# EAGLE schematic Arche-RoboCore (EAGLE 9.6.2)

## Sheet 1 of 2
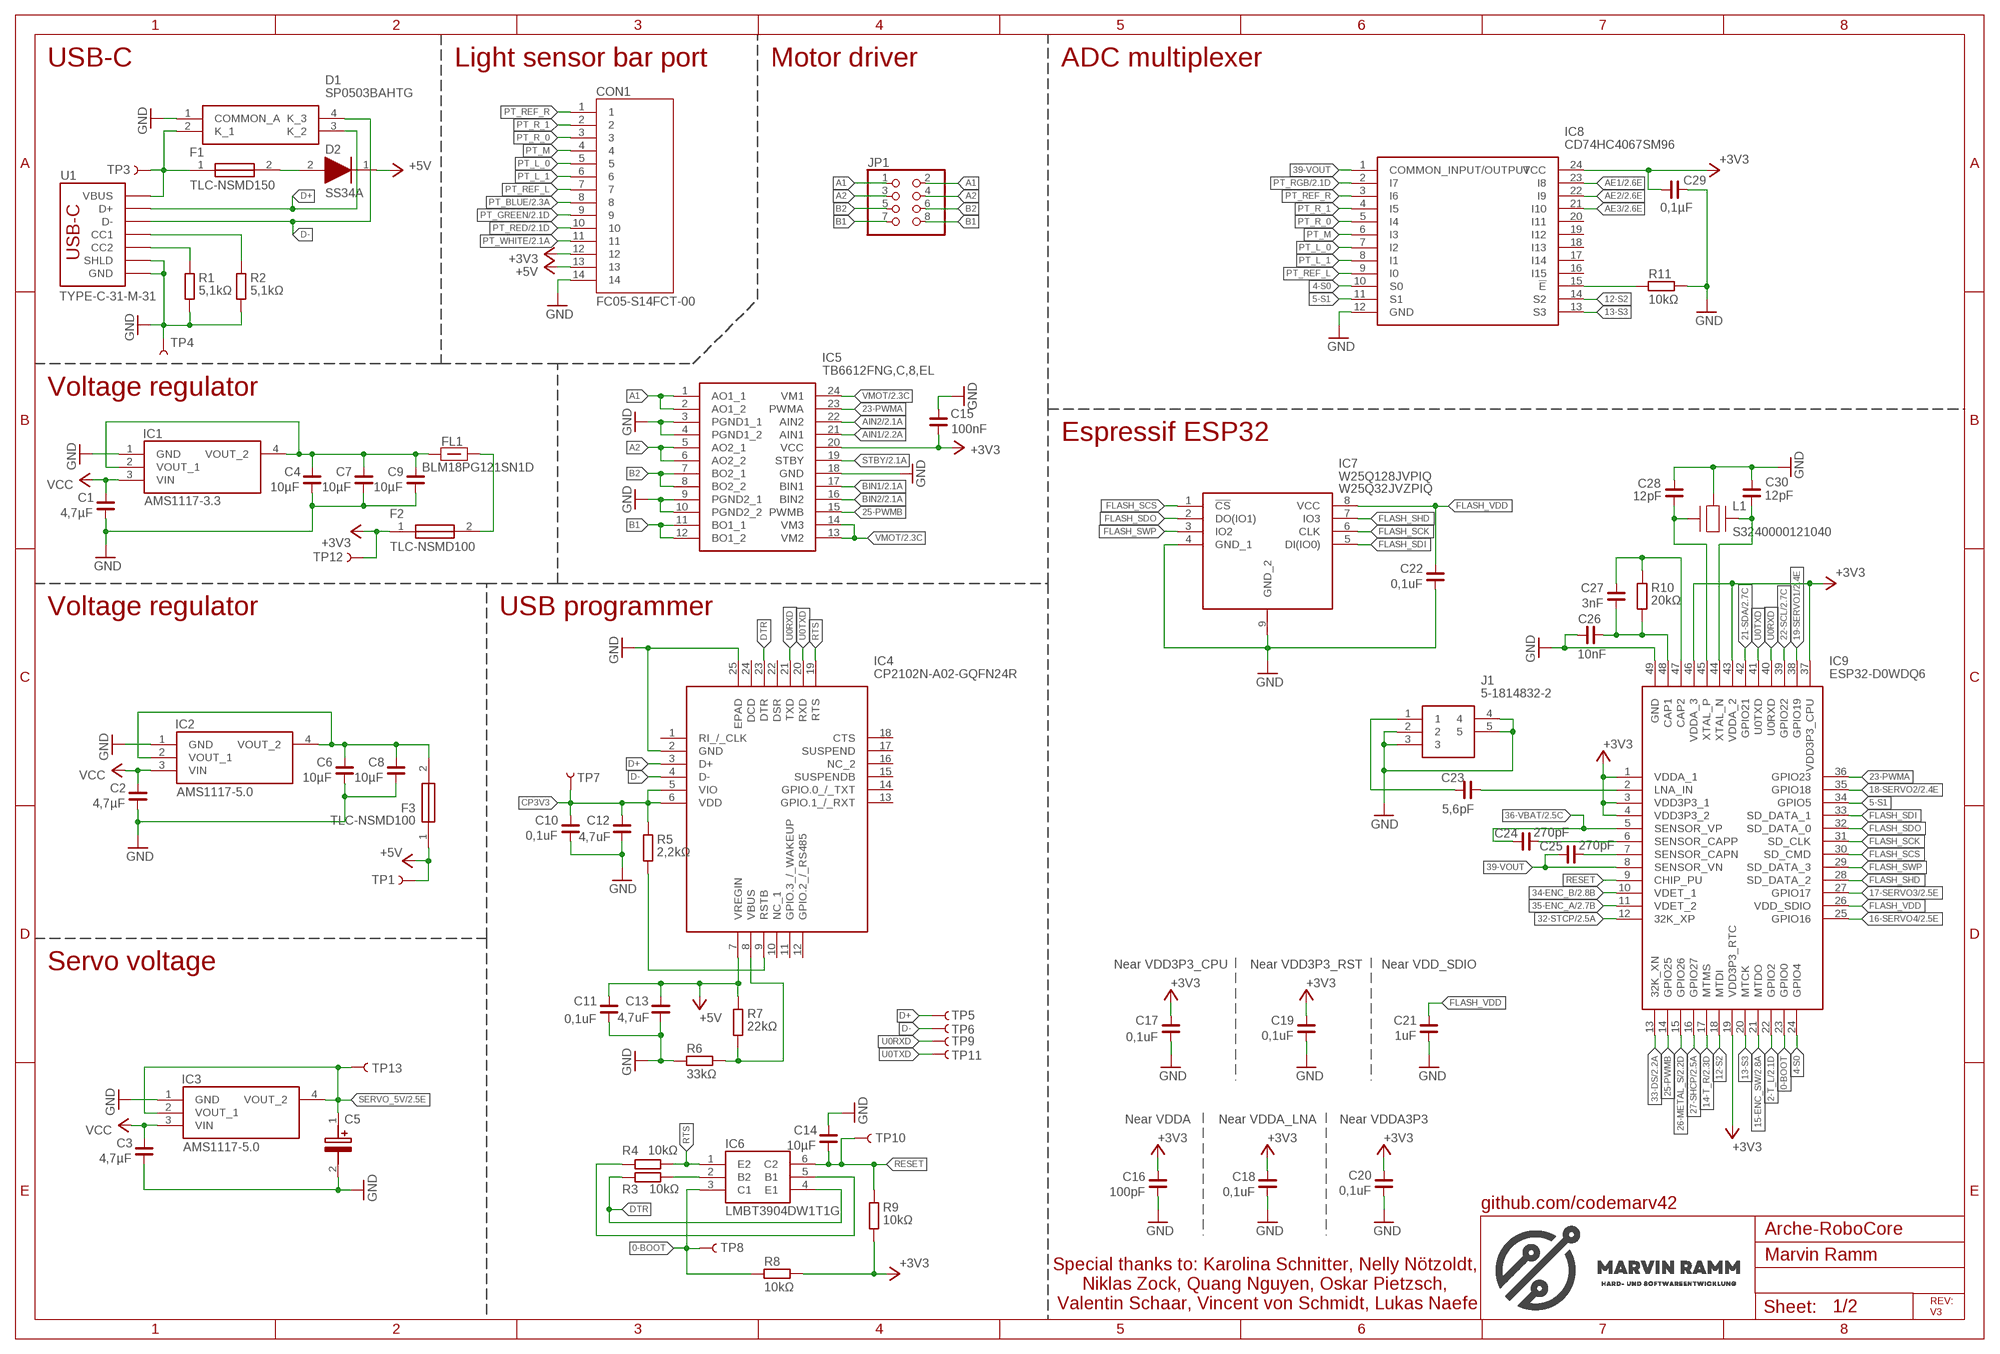
[diagram p0: schematic, sheet 1]

### Parts
C1  4,7µF  C_0603  [C0603]
C2  4,7µF  C_0603  [C0603]
C3  4,7µF  C_0603  [C0603]
C4  10µF  C_0603  [C0603]
C5  UUD1C151MCL1GS  [CAPAE660X800N]
C6  10µF  C_0603  [C0603]
C7  10µF  C_0603  [C0603]
C8  10µF  C_0603  [C0603]
C9  10µF  C_0603  [C0603]
C10  0,1uF  C_0402  [C0402]
C11  0,1uF  C_0402  [C0402]
C12  4,7uF  C_0402  [C0402]
C13  4,7uF  C_0402  [C0402]
C14  10µF  C_0603  [C0603]
C15  100nF  C_0402  [C0402]
C16  100pF  C_0402  [C0402]
C17  0,1uF  C_0402  [C0402]
C18  0,1uF  C_0402  [C0402]
C19  0,1uF  C_0402  [C0402]
C20  0,1uF  C_0402  [C0402]
C21  1uF  C_0402  [C0402]
C22  0,1uF  C_0402  [C0402]
C23  5,6pF  C_0402  [C0402]
C24  270pF  C_0402  [C0402]
C25  270pF  C_0402  [C0402]
C26  10nF  C_0402  [C0402]
C27  3nF  C_0402  [C0402]
C28  12pF  C_0402  [C0402]
C29  0,1µF  C_0402  [C0402]
C30  12pF  C_0402  [C0402]
CON1  FC05-S14FCT-00  [FC05-S14FCT-00]
D1  SP0503BAHTG  [SP0503BAHTG]
D2  SS34A  [DIOM5026X262N]
F1  NANOSMDC020F-2  [FUSC3216X82N]
F2  NANOSMDC020F-2  [FUSC3216X82N]
F3  NANOSMDC020F-2  [FUSC3216X82N]
FL1  BLM18PG121SN1D  [BLM18AG102BH1D]
IC1  AMS1117-3.3  [SOT229P700X180-4N]
IC2  AMS1117-3.3  [SOT229P700X180-4N]
IC3  AMS1117-3.3  [SOT229P700X180-4N]
IC4  CP2102N-A02-GQFN24R  [QFN50P400X400X80-25N]
IC5  TB6612FNG,C,8,EL  [SOP65P760X160-24N]
IC6  MMDT3904-TP  [SOT65P230X120-6N]
IC7  W25Q128JVPIQ  [SON127P800X600X80-9N]
IC8  CD74HC4067SM96  [SOP65P780X200-24N]
IC9  ESP32-D0WDQ6  [QFN40P600X600X90-49N]
J1  5-1814832-2  [518148322]
JP1  PINHD-2X4  [2X04]
L1  SMD-3225_4P16MHZ_20PF_10PPM_-4  [SMD3225_4P16MHZ20PF10PPM4085]
R1  5,1kΩ  R_0402  [R0402]
R2  5,1kΩ  R_0402  [R0402]
R3  10kΩ  R_0402  [R0402]
R4  10kΩ  R_0402  [R0402]
R5  2,2kΩ  R_0402  [R0402]
R6  33kΩ  R_0402  [R0402]
R7  22kΩ  R_0402  [R0402]
R8  10kΩ  R_0402  [R0402]
R9  10kΩ  R_0402  [R0402]
R10  20kΩ  R_0402  [R0402]
R11  10kΩ  R_0402  [R0402]
TP1  TEST-POINT3X5  [PAD.03X.05]
TP3  TEST-POINT3X5  [PAD.03X.05]
TP4  TEST-POINT3X5  [PAD.03X.05]
TP5  TEST-POINT3X5  [PAD.03X.05]
TP6  TEST-POINT3X5  [PAD.03X.05]
TP7  TEST-POINT3X5  [PAD.03X.05]
TP8  TEST-POINT3X5  [PAD.03X.05]
TP9  TEST-POINT3X5  [PAD.03X.05]
TP10  TEST-POINT3X5  [PAD.03X.05]
TP11  TEST-POINT3X5  [PAD.03X.05]
TP12  TEST-POINT3X5  [PAD.03X.05]
TP13  TEST-POINT3X5  [PAD.03X.05]
U1  TYPE-C-31-M-14  [TYPE-C-31-M-14_HRO]

### Nets
0-BOOT: IC6.3(C1) IC9.23(GPIO0) R8.2 TP8.1
2-T_L: IC9.22(GPIO2) ; also sheet 2
4-S0: IC8.10(S0) IC9.24(GPIO4)
5-S1: IC8.11(S1) IC9.34(GPIO5)
12-S2: IC8.14(S2) IC9.18(MTDI)
13-S3: IC8.13(S3) IC9.20(MTCK)
14-T_R: IC9.17(MTMS) ; also sheet 2
15-ENC_SW: IC9.21(MTDO) ; also sheet 2
16-SERVO4: IC9.25(GPIO16) ; also sheet 2
17-SERVO3: IC9.27(GPIO17) ; also sheet 2
18-SERVO2: IC9.35(GPIO18) ; also sheet 2
19-SERVO1: IC9.38(GPIO19) ; also sheet 2
21-SDA: IC9.42(GPIO21) ; also sheet 2
22-SCL: IC9.39(GPIO22) ; also sheet 2
23-PWMA: IC5.23(PWMA) IC9.36(GPIO23)
25-PWMB: IC5.15(PWMB) IC9.14(GPIO25)
26-METAL_S: IC9.15(GPIO26) ; also sheet 2
27-SHCP: IC9.16(GPIO27) ; also sheet 2
32-STCP: IC9.12(32K_XP) ; also sheet 2
33-DS: IC9.13(32K_XN) ; also sheet 2
34-ENC_B: IC9.10(VDET_1) ; also sheet 2
35-ENC_A: IC9.11(VDET_2) ; also sheet 2
36-VBAT: C24.1 IC9.5(SENSOR_VP) ; also sheet 2
39-VOUT: C25.1 IC8.1(COMMON_INPUT/OUTPUT) IC9.8(SENSOR_VN)
+3V3: C15.1 C16.2 C17.2 C18.2 C19.2 C20.2 C29.1 CON1.12 F2.1 IC5.20(VCC) IC8.24(VCC) IC9.1(VDDA_1) IC9.3(VDD3P3_1) IC9.4(VDD3P3_2) IC9.19(VDD3P3_RTC) IC9.37(VDD3P3_CPU) IC9.43(VDDA_2) IC9.46(VDDA_3) R8.1 R9.2 TP12.1 ; also sheet 2
+5V: C11.2 C13.2 CON1.13 D2.1(K) F3.1 IC4.7(VREGIN) R7.1 TP1.1 ; also sheet 2
A1: IC5.1(AO1_1) IC5.2(AO1_2) JP1.1 JP1.2
A2: IC5.5(AO2_1) IC5.6(AO2_2) JP1.3 JP1.4
AE1: IC8.23(I8) ; also sheet 2
AE2: IC8.22(I9) ; also sheet 2
AE3: IC8.21(I10) ; also sheet 2
AIN1: IC5.21(AIN1) ; also sheet 2
AIN2: IC5.22(AIN2) ; also sheet 2
B1: IC5.11(BO1_1) IC5.12(BO1_2) JP1.7 JP1.8
B2: IC5.7(BO2_1) IC5.8(BO2_2) JP1.5 JP1.6
BIN1: IC5.17(BIN1) ; also sheet 2
BIN2: IC5.16(BIN2) ; also sheet 2
CP3V3: C10.2 C12.2 IC4.5(VIO) IC4.6(VDD) R5.1 TP7.1
D+: D1.3(K_2) IC4.3(D+) TP5.1 U1.A6(D+) U1.B6(D+)
D-: D1.4(K_3) IC4.4(D-) TP6.1 U1.A7(D-) U1.B7(D-)
DTR: IC4.23(DTR) IC6.4(E1) R3.2
FLASH_SCK: IC7.6(CLK) IC9.31(SD_CLK)
FLASH_SCS: IC7.1(!CS) IC9.30(SD_CMD)
FLASH_SDI: IC7.5(DI(IO0)) IC9.33(SD_DATA_1)
FLASH_SDO: IC7.2(DO(IO1)) IC9.32(SD_DATA_0)
FLASH_SHD: IC7.7(IO3) IC9.28(SD_DATA_2)
FLASH_SWP: IC7.3(IO2) IC9.29(SD_DATA_3)
FLASH_VDD: C21.2 C22.2 IC7.8(VCC) IC9.26(VDD_SDIO)
GND: C1.2 C2.2 C3.2 C4.2 C5.2(-) C6.2 C7.2 C8.2 C9.2 C10.1 C11.1 C12.1 C13.1 C14.1 C15.2 C16.1 C17.1 C18.1 C19.1 C20.1 C21.1 C22.1 C26.1 C28.1 C29.2 C30.1 CON1.14 D1.1(COMMON_A) IC1.1(GND) IC2.1(GND) IC3.1(GND) IC4.2(GND) IC4.25(EPAD) IC5.3(PGND1_1) IC5.4(PGND1_2) IC5.9(PGND2_1) IC5.10(PGND2_2) IC5.18(GND) IC7.4(GND_1) IC7.9(GND_2) IC8.12(GND) IC9.49(GND) J1.2 J1.3 J1.4 J1.5 L1.2(GND_2) L1.4(GND_2) R1.2 R2.2 R6.2 R11.2 TP4.1 U1.A1B12(GND) U1.B1A12(GND) U1.P$1(SHLD) U1.P$2(SHLD) U1.P$3(SHLD) U1.P$4(SHLD) U1.P$5(SHLD) U1.P$6(SHLD) U1.P$7(SHLD) U1.P$8(SHLD) U1.P$9(SHLD) U1.P$10(SHLD) U1.P$11(SHLD) U1.P$12(SHLD) U1.P$14(SHLD) U1.P$16(SHLD) U1.P$18(SHLD) U1.P$20(SHLD) ; also sheet 2
N$5: D2.2(A) F1.2
N$7: C6.1 C8.1 F3.2 IC2.2(VOUT_1) IC2.4(VOUT_2)
N$8: F2.2 FL1.1
N$9: C4.1 C7.1 C9.1 FL1.2 IC1.2(VOUT_1) IC1.4(VOUT_2)
N$10: R1.1 U1.B5(CC2)
N$11: R2.1 U1.A5(CC1)
N$12: IC4.9(RSTB) R5.2
N$13: IC4.8(VBUS) R6.1 R7.2
N$20: IC8.15(!E) R11.1
N$23: C23.1 IC9.2(LNA_IN)
N$24: C26.2 C27.1 IC9.48(CAP1) R10.2
N$25: C27.2 IC9.47(CAP2) R10.1
N$26: C30.2 IC9.44(XTAL_N) L1.3(CRYSTAL_2)
N$27: C28.2 IC9.45(XTAL_P) L1.1(CRYSTAL_1)
N$29: C23.2 J1.1
N$37: IC6.5(B1) R4.2
N$38: IC6.2(B2) R3.1
N$39: C25.2 IC9.7(SENSOR_CAPN)
N$41: C24.2 IC9.6(SENSOR_CAPP)
PT_BLUE: CON1.8 ; also sheet 2
PT_GREEN: CON1.9 ; also sheet 2
PT_L_0: CON1.5 IC8.7(I2)
PT_L_1: CON1.6 IC8.8(I1)
PT_M: CON1.4 IC8.6(I3)
PT_R_0: CON1.3 IC8.5(I4)
PT_R_1: CON1.2 IC8.4(I5)
PT_RED: CON1.10 ; also sheet 2
PT_REF_L: CON1.7 IC8.9(I0)
PT_REF_R: CON1.1 IC8.3(I6)
PT_RGB: IC8.2(I7) ; also sheet 2
PT_WHITE: CON1.11 ; also sheet 2
RESET: C14.2 IC6.6(C2) IC9.9(CHIP_PU) R9.1 TP10.1
RTS: IC4.19(RTS) IC6.1(E2) R4.1
SERVO_5V: C5.1(+) IC3.2(VOUT_1) IC3.4(VOUT_2) TP13.1 ; also sheet 2
STBY: IC5.19(STBY) ; also sheet 2
U0RXD: IC4.21(TXD) IC9.40(U0RXD) TP9.1
U0TXD: IC4.20(RXD) IC9.41(U0TXD) TP11.1
USBDIRECT: D1.2(K_1) F1.1 TP3.1 U1.A4B9(VBUS) U1.B4A9(VBUS)
VCC: C1.1 C2.1 C3.1 IC1.3(VIN) IC2.3(VIN) IC3.3(VIN) ; also sheet 2
VMOT: IC5.13(VM2) IC5.14(VM3) IC5.24(VM1) ; also sheet 2
Unconnected: IC4.1(RI_/_CLK) IC4.10(NC_1) IC4.11(GPIO.3_/_WAKEUP) IC4.12(GPIO.2_/_RS485) IC4.13(GPIO.1_/_RXT) IC4.14(GPIO.0_/_TXT) IC4.15(SUSPENDB) IC4.16(NC_2) IC4.17(SUSPEND) IC4.18(CTS) IC4.22(DSR) IC4.24(DCD) IC8.16(I15) IC8.17(I14) IC8.18(I13) IC8.19(I12) IC8.20(I11)

### Notes on the sheet
- USB-C | Light sensor bar port | Motor driver | ADC multiplexer
- TLC-NSMD150
- TYPE-C-31-M-31
- Voltage regulator
- Espressif ESP32
- W25Q32JVZPIQ
- S3240000121040
- TLC-NSMD100
- Voltage regulator | USB programmer
- AMS1117-5.0
- TLC-NSMD100
- Near VDD3P3_CPU | Near VDD3P3_RST | Near VDD_SDIO
- Servo voltage
- Near VDDA | Near VDDA_LNA | Near VDDA3P3
- AMS1117-5.0
- LMBT3904DW1T1G | github.com/codemarv42
- Marvin Ramm
- Special thanks to: Karolina Schnitter, Nelly Nötzoldt, 
  Niklas Zock, Quang Nguyen, Oskar Pietzsch, 
  Valentin Schaar, Vincent von Schmidt, Lukas Naefe
- REV:
  V3

## Sheet 2 of 2
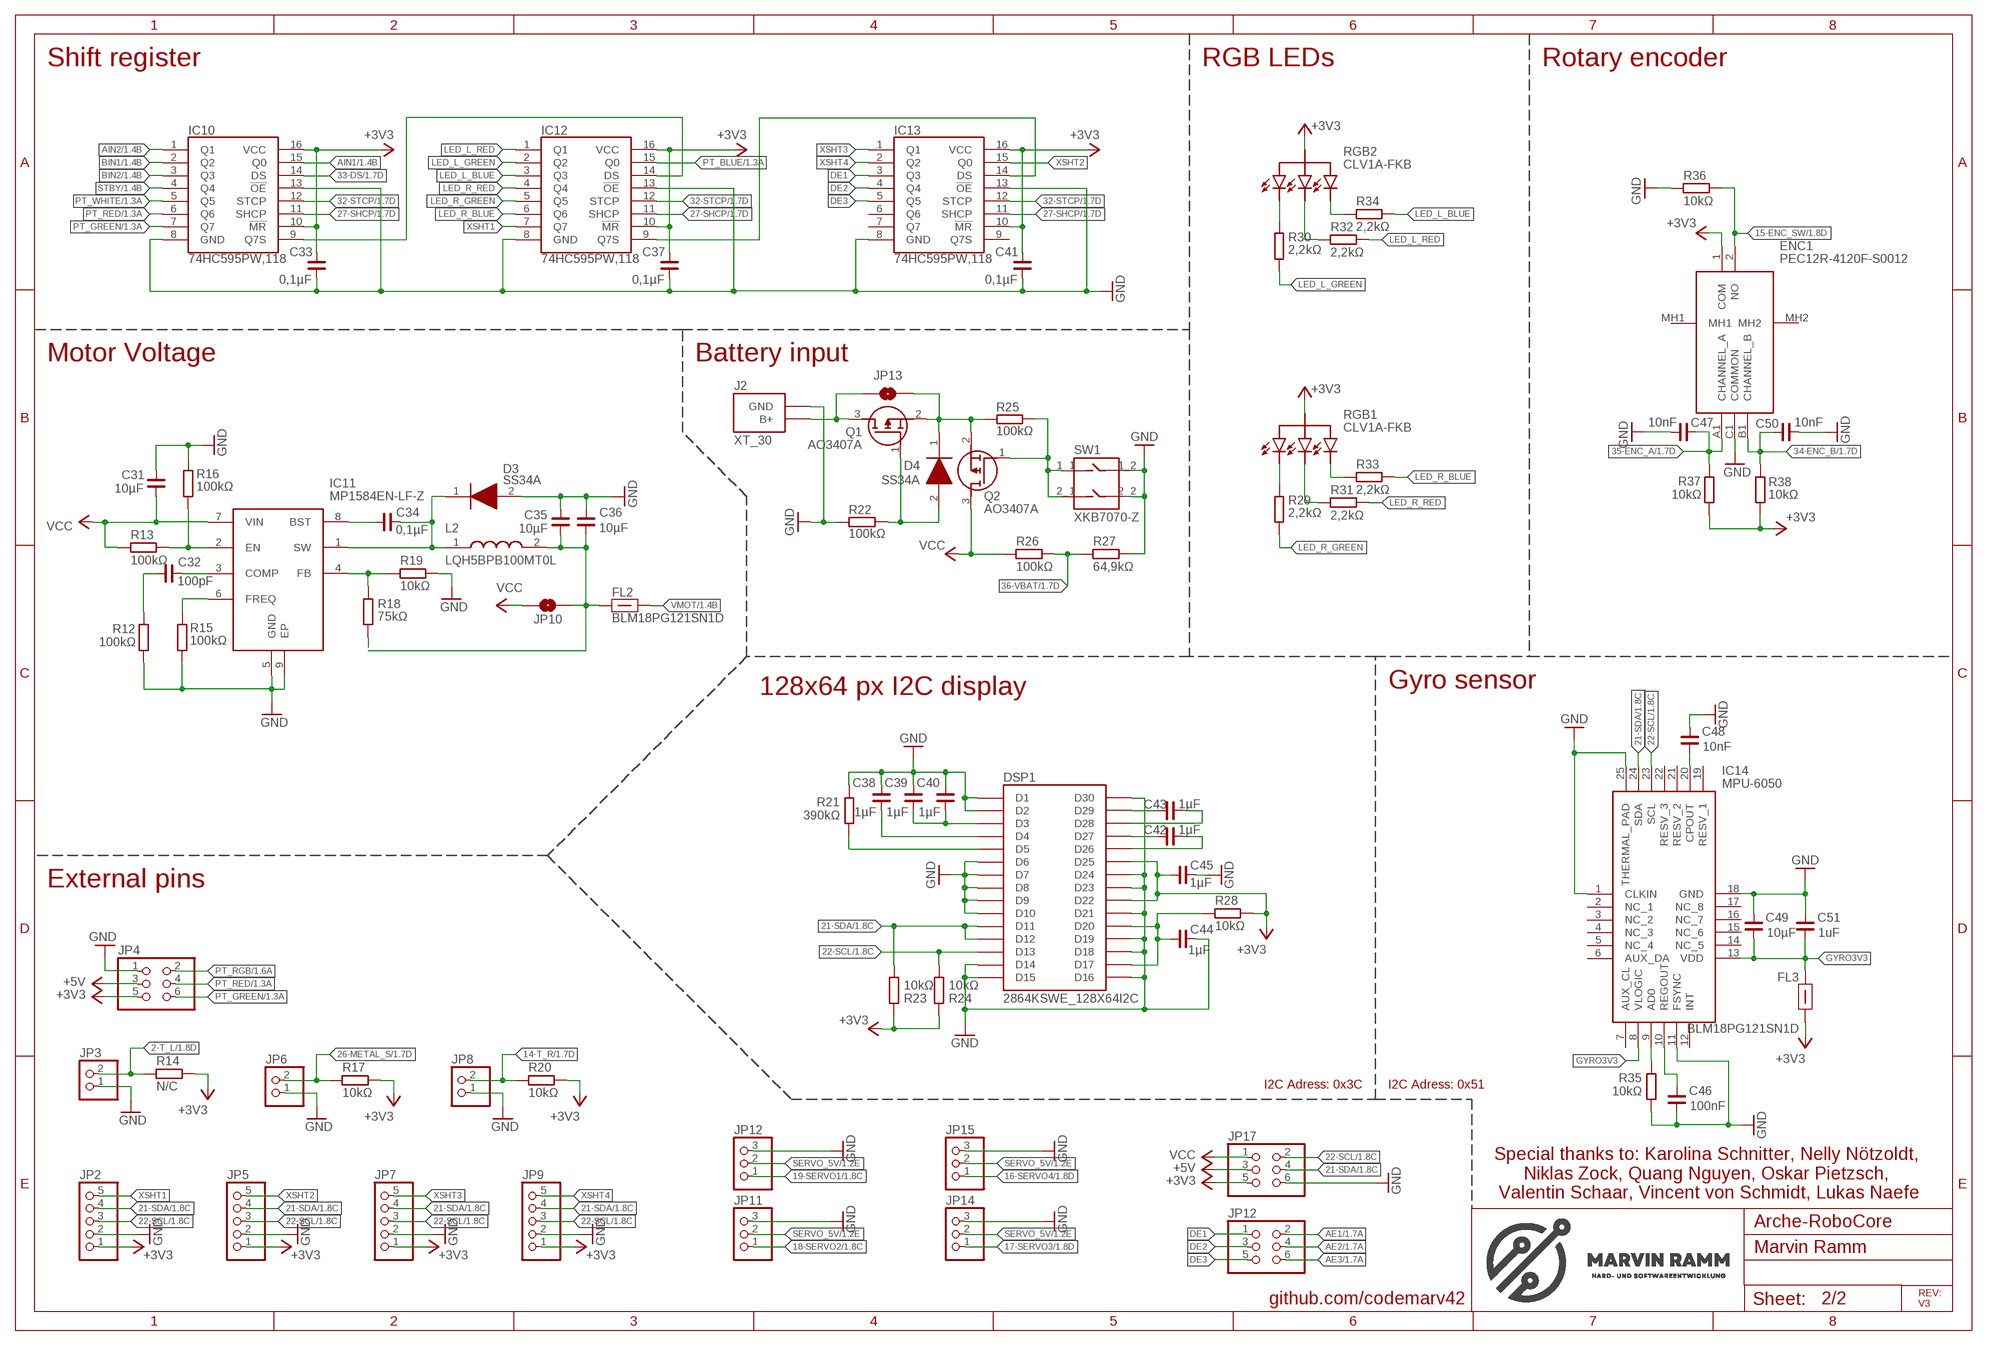
[diagram p1: schematic, sheet 2]

### Parts
C31  10µF  C_0603  [C0603]
C32  100pF  C_0402  [C0402]
C33  0,1µF  C_0402  [C0402]
C34  0,1µF  C_0402  [C0402]
C35  10µF  C_0603  [C0603]
C36  10µF  C_0603  [C0603]
C37  0,1µF  C_0402  [C0402]
C38  1µF  C_0402  [C0402]
C39  1µF  C_0402  [C0402]
C40  1µF  C_0402  [C0402]
C41  0,1µF  C_0402  [C0402]
C42  1µF  C_0402  [C0402]
C43  1µF  C_0402  [C0402]
C44  1µF  C_0402  [C0402]
C45  1µF  C_0402  [C0402]
C46  100nF  C_0402  [C0402]
C47  10nF  C_0402  [C0402]
C48  10nF  C_0402  [C0402]
C49  10µF  C_0603  [C0603]
C50  10nF  C_0402  [C0402]
C51  1uF  C_0402  [C0402]
D3  SS34A  [DIOM5026X262N]
D4  SS34A  [DIOM5026X262N]
DSP1  2864KSWE_128X64I2C  [2864KSWE_128X64I2C]
ENC1  PEC12R-4230F-S0024  [PEC12R4230FS0024]
FL2  BLM18PG121SN1D  [BLM18AG102BH1D]
FL3  BLM18PG121SN1D  [BLM18AG102BH1D]
IC10  74HC595PW,118  [SOP65P640X110-16N]
IC11  MP1584EN-LF-Z  [SOIC127P600X170-9N]
IC12  74HC595PW,118  [SOP65P640X110-16N]
IC13  74HC595PW,118  [SOP65P640X110-16N]
IC14  MPU-6050  [QFN50P400X400X95-25N]
J2  XT_30  [XT_30]
JP2  PINHD-1X5  [1X05]
JP3  PINHD-1X2  [1X02]
JP4  PINHD-2X3  [2X03]
JP5  PINHD-1X5  [1X05]
JP6  PINHD-1X2  [1X02]
JP7  PINHD-1X5  [1X05]
JP8  PINHD-1X2  [1X02]
JP9  PINHD-1X5  [1X05]
JP10  JUMPER-SMT_2_NO_SILK  [SMT-JUMPER_2_NO_SILK]
JP11  PINHD-1X3  [1X03]
JP12  PINHD-1X3  [1X03]
JP13  JUMPER-SMT_2_NO_SILK  [SMT-JUMPER_2_NO_SILK]
JP14  PINHD-1X3  [1X03]
JP15  PINHD-1X3  [1X03]
JP16  PINHD-2X3  [2X03]
JP17  PINHD-2X3  [2X03]
L2  LQH5BPB100MT0L  [LQH5BPB100MT0L]
Q1  AO3407A  [SOT95P280X125-3N]
Q2  AO3407A  [SOT95P280X125-3N]
R12  100kΩ  R_0402  [R0402]
R13  100kΩ  R_0402  [R0402]
R14  N/C  R_0402  [R0402]
R15  100kΩ  R_0402  [R0402]
R16  100kΩ  R_0402  [R0402]
R17  10kΩ  R_0402  [R0402]
R18  75kΩ  R_0402  [R0402]
R19  10kΩ  R_0402  [R0402]
R20  10kΩ  R_0402  [R0402]
R21  390kΩ  R_0402  [R0402]
R22  100kΩ  R_0402  [R0402]
R23  10kΩ  R_0402  [R0402]
R24  10kΩ  R_0402  [R0402]
R25  100kΩ  R_0402  [R0402]
R26  100kΩ  R_0402  [R0402]
R27  64,9kΩ  R_0402  [R0402]
R28  10kΩ  R_0402  [R0402]
R29  2,2kΩ  R_0402  [R0402]
R30  2,2kΩ  R_0402  [R0402]
R31  2,2kΩ  R_0402  [R0402]
R32  2,2kΩ  R_0402  [R0402]
R33  2,2kΩ  R_0402  [R0402]
R34  2,2kΩ  R_0402  [R0402]
R35  10kΩ  R_0402  [R0402]
R36  10kΩ  R_0402  [R0402]
R37  10kΩ  R_0402  [R0402]
R38  10kΩ  R_0402  [R0402]
RGB1  RGBLED  [RGBLED]
RGB2  RGBLED  [RGBLED]
SW1  XKB7070-Z  [XKB7070-Z]

### Nets
2-T_L: JP3.2 R14.1 ; also sheet 1
14-T_R: JP8.2 R20.1 ; also sheet 1
15-ENC_SW: ENC1.2(NO) R36.2 ; also sheet 1
16-SERVO4: JP15.1 ; also sheet 1
17-SERVO3: JP14.1 ; also sheet 1
18-SERVO2: JP11.1 ; also sheet 1
19-SERVO1: JP12.1 ; also sheet 1
21-SDA: DSP1.D11 DSP1.D12 IC14.24(SDA) JP2.4 JP5.4 JP7.4 JP9.4 JP17.4 R23.1 ; also sheet 1
22-SCL: DSP1.D13 IC14.23(SCL) JP2.3 JP5.3 JP7.3 JP9.3 JP17.2 R24.1 ; also sheet 1
26-METAL_S: JP6.2 R17.1 ; also sheet 1
27-SHCP: IC10.11(SHCP) IC12.11(SHCP) IC13.11(SHCP) ; also sheet 1
32-STCP: IC10.12(STCP) IC12.12(STCP) IC13.12(STCP) ; also sheet 1
33-DS: IC10.14(DS) ; also sheet 1
34-ENC_B: C50.1 ENC1.B1(CHANNEL_B) R38.2 ; also sheet 1
35-ENC_A: C47.1 ENC1.A1(CHANNEL_A) R37.2 ; also sheet 1
36-VBAT: R26.2 R27.1 ; also sheet 1
+3V3: C33.1 C37.1 C41.1 C45.1 DSP1.D22 DSP1.D25 ENC1.1(COM) FL3.1 IC10.10(!MR) IC10.16(VCC) IC12.10(!MR) IC12.16(VCC) IC13.10(!MR) IC13.16(VCC) JP2.1 JP4.5 JP5.1 JP7.1 JP9.1 JP17.5 R14.2 R17.2 R20.2 R23.2 R24.2 R28.2 R37.1 R38.1 RGB1.+5V RGB2.+5V ; also sheet 1
+5V: JP4.3 JP17.3 ; also sheet 1
AE1: JP16.2 ; also sheet 1
AE2: JP16.4 ; also sheet 1
AE3: JP16.6 ; also sheet 1
AIN1: IC10.15(Q0) ; also sheet 1
AIN2: IC10.1(Q1) ; also sheet 1
BIN1: IC10.2(Q2) ; also sheet 1
BIN2: IC10.3(Q3) ; also sheet 1
DE1: IC13.3(Q3) JP16.1
DE2: IC13.4(Q4) JP16.3
DE3: IC13.5(Q5) JP16.5
GND: C31.1 C33.2 C35.1 C36.1 C37.2 C38.1 C39.1 C40.1 C41.2 C44.2 C45.2 C46.1 C47.2 C48.2 C49.1 C50.2 C51.2 D3.2(A) DSP1.D1 DSP1.D2 DSP1.D6 DSP1.D7 DSP1.D8 DSP1.D9 DSP1.D10 DSP1.D14 DSP1.D15 DSP1.D16 DSP1.D18 DSP1.D19 DSP1.D21 DSP1.D23 DSP1.D24 DSP1.D30 ENC1.C1(COMMON) IC10.8(GND) IC10.13(!OE) IC11.5(GND) IC11.9(EP) IC12.8(GND) IC12.13(!OE) IC13.8(GND) IC13.13(!OE) IC14.1(CLKIN) IC14.11(FSYNC) IC14.18(GND) IC14.25(THERMAL_PAD) J2.GND JP2.2 JP3.1 JP4.1 JP5.2 JP6.1 JP7.2 JP8.1 JP9.2 JP11.3 JP12.3 JP14.3 JP15.3 JP17.6 R12.2 R15.2 R16.1 R19.1 R21.2 R22.1 R27.2 R35.1 R36.1 SW1.1_2 SW1.2_2 ; also sheet 1
GYRO3V3: C49.2 C51.1 FL3.2 IC14.8(VLOGIC) IC14.13(VDD)
LED_L_BLUE: IC12.3(Q3) R34.2
LED_L_GREEN: IC12.2(Q2) R30.2
LED_L_RED: IC12.1(Q1) R32.2
LED_R_BLUE: IC12.6(Q6) R33.2
LED_R_GREEN: IC12.5(Q5) R29.2
LED_R_RED: IC12.4(Q4) R31.2
N$1: C48.1 IC14.20(CPOUT)
N$2: C46.2 IC14.10(REGOUT)
N$3: IC14.9(AD0) R35.2
N$4: Q2.1(G) R25.2 SW1.1_1 SW1.2_1
N$6: IC12.9(Q7S) IC13.14(DS)
N$14: D4.1(K) JP13.1 Q1.2(S) Q2.2(S) R25.1
N$15: D4.2(A) Q1.1(G) R22.2
N$16: J2.B+ JP13.2 Q1.3(D)
N$17: C35.2 C36.2 FL2.2 JP10.1 L2.2 R18.2
N$19: IC11.2(EN) R13.1 R16.2
N$21: IC11.6(FREQ) R15.1
N$22: C32.2 IC11.3(COMP)
N$28: C42.1 DSP1.D27
N$30: C44.1 DSP1.D17 DSP1.D20 R28.1
N$31: C38.2 DSP1.D4
N$32: C42.2 DSP1.D26
N$33: C39.2 C40.2 DSP1.D3
N$34: DSP1.D5 R21.1
N$35: C43.1 DSP1.D29
N$36: C43.2 DSP1.D28
N$42: C32.1 R12.1
N$44: C34.2 D3.1(K) IC11.1(SW) L2.1
N$45: R30.1 RGB2.P3
N$46: R34.1 RGB2.P1
N$47: R32.1 RGB2.P2
N$48: C34.1 IC11.8(BST)
N$49: IC10.9(Q7S) IC12.14(DS)
N$50: R29.1 RGB1.P3
N$51: R33.1 RGB1.P1
N$52: R31.1 RGB1.P2
N$87: IC11.4(FB) R18.1 R19.2
PT_BLUE: IC12.15(Q0) ; also sheet 1
PT_GREEN: IC10.7(Q7) JP4.6 ; also sheet 1
PT_RED: IC10.6(Q6) JP4.4 ; also sheet 1
PT_RGB: JP4.2 ; also sheet 1
PT_WHITE: IC10.5(Q5) ; also sheet 1
SERVO_5V: JP11.2 JP12.2 JP14.2 JP15.2 ; also sheet 1
STBY: IC10.4(Q4) ; also sheet 1
VCC: C31.2 IC11.7(VIN) JP10.2 JP17.1 Q2.3(D) R13.2 R26.1 ; also sheet 1
VMOT: FL2.1 ; also sheet 1
XSHT1: IC12.7(Q7) JP2.5
XSHT2: IC13.15(Q0) JP5.5
XSHT3: IC13.1(Q1) JP7.5
XSHT4: IC13.2(Q2) JP9.5
Unconnected: ENC1.MH1 ENC1.MH2 IC13.6(Q6) IC13.7(Q7) IC13.9(Q7S) IC14.2(NC_1) IC14.3(NC_2) IC14.4(NC_3) IC14.5(NC_4) IC14.6(AUX_DA) IC14.7(AUX_CL) IC14.12(INT) IC14.14(NC_5) IC14.15(NC_6) IC14.16(NC_7) IC14.17(NC_8) IC14.19(RESV_1) IC14.21(RESV_2) IC14.22(RESV_3)

### Notes on the sheet
- Shift register | RGB LEDs | Rotary encoder
- RGB2
- CLV1A-FKB
- PEC12R-4120F-S0012
- Motor Voltage | Battery input
- RGB1
- CLV1A-FKB
- 128x64 px I2C display | Gyro sensor
- External pins
- JP4
- I2C Adress: 0x3C
- I2C Adress: 0x51
- Special thanks to: Karolina Schnitter, Nelly Nötzoldt, 
  Niklas Zock, Quang Nguyen, Oskar Pietzsch, 
  Valentin Schaar, Vincent von Schmidt, Lukas Naefe
- JP12
- Marvin Ramm
- github.com/codemarv42
- REV:
  V3

## Library data of the parts
C1-C4 C6-C51 = rc-master-smd:C_: NON-POLARIZED CAP
C5 = UUD1C151MCL1GS:UUD1C151MCL1GS: Cap Aluminum Lytic 150uF 16V 20% (6.3 X 7.7mm) SMD 280mA 2000h 105C Automotive T/R Source: Datasheet <https://datasheet.datasheetarchive.com/originals/dk/DKDS-9/176751.pdf>; ARROW_PART_NUMBER: UUD1C151MCL1GS; ARROW_PRICE-STOCK: https://www.arrow.com/en/products/uud1c151mcl1gs/nichicon; DESCRIPTION: Cap Aluminum Lytic 150uF 16V 20% (6.3 X 7.7mm) SMD 280mA 2000h 105C Automotive T/R; HEIGHT: 8mm; MANUFACTURER_NAME: Nichicon; MANUFACTURER_PART_NUMBER: UUD1C151MCL1GS; MOUSER_PART_NUMBER: 647-UUD1C151MCL; MOUSER_PRICE-STOCK: https://www.mouser.com/Search/Refine.aspx?Keyword=647-UUD1C151MCL
CON1 = FC05-S14FCT-00:FC05-S14FCT-00
D1 = SP0503BAHTG:SP0503BAHTG: ESD Suppressors / TVS Diodes TVS AVAL DIODE SMT Source: Datasheet <https://nl.mouser.com/datasheet/2/240/Littelfuse_TVS_Diode_Array_SP05_Datasheet.pdf-777043.pdf>; ARROW_PART_NUMBER: SP0503BAHTG; ARROW_PRICE-STOCK: https://www.arrow.com/en/products/sp0503bahtg/littelfuse?region=nac; DESCRIPTION: ESD Suppressors / TVS Diodes TVS AVAL DIODE SMT; HEIGHT: 1.22mm; MANUFACTURER_NAME: LITTELFUSE; MANUFACTURER_PART_NUMBER: SP0503BAHTG; MOUSER_PART_NUMBER: 576-SP0503BAHTG; MOUSER_PRICE-STOCK: https://www.mouser.co.uk/ProductDetail/Littelfuse/SP0503BAHTG?qs=uD%2FdkN7XIa0NTYXwHdELYA%3D%3D
D2-D4 = SS34A:SS34A: MULTICOMP - SS34A - DIODE, RECTIFIER, 3A, 40V, DO-214AC Source: Datasheet <https://componentsearchengine.com/Datasheets/2/SS34A.pdf>; DESCRIPTION: MULTICOMP - SS34A - DIODE, RECTIFIER, 3A, 40V, DO-214AC; HEIGHT: 2.62mm; MANUFACTURER_NAME: MULTICOMP; MANUFACTURER_PART_NUMBER: SS34A
DSP1 = 2864KSWE_128X64I2C:2864KSWE_128X64I2C
ENC1 = PEC12R-4230F-S0024:PEC12R-4230F-S0024: Encoder 30mm Shaft w/Switch 24 pulses Bourns 24 Pulse Incremental Mechanical Rotary Encoder with a 6 mm Flat Shaft, Through Hole Source: Datasheet <http://www.bourns.com/data/global/pdfs/PEC12R.pdf>; ARROW_PART_NUMBER: PEC12R-4230F-S0024; ARROW_PRICE-STOCK: https://www.arrow.com/en/products/pec12r-4230f-s0024/bourns?region=nac; DESCRIPTION: Encoder 30mm Shaft w/Switch 24 pulses Bourns 24 Pulse Incremental Mechanical Rotary Encoder with a 6 mm Flat Shaft, Through Hole; HEIGHT: 30.5mm; MANUFACTURER_NAME: Bourns; MANUFACTURER_PART_NUMBER: PEC12R-4230F-S0024; MOUSER_PART_NUMBER: 652-PEC12R-4230F-S24; MOUSER_PRICE-STOCK: https://www.mouser.co.uk/ProductDetail/Bourns/PEC12R-4230F-S0024?qs=Zq5ylnUbLm78S3yGzO6hng%3D%3D
F1-F3 = NANOSMDC020F-2:NANOSMDC020F-2: LITTELFUSE - NANOSMDC020F-2 - POLYSWITCH, SMD, 1206, 0.2A Source: Datasheet <https://www.littelfuse.com/~/media/electronics/product_specifications/resettable_ptcs/littelfuse_ptc_nanosmdc020f_2_product_specification.pdf.pdf>; ARROW_PART_NUMBER: NANOSMDC020F-2; ARROW_PRICE-STOCK: https://www.arrow.com/en/products/nanosmdc020f-2/littelfuse; DESCRIPTION: LITTELFUSE - NANOSMDC020F-2 - POLYSWITCH, SMD, 1206, 0.2A; HEIGHT: 0.82mm; MANUFACTURER_NAME: LITTELFUSE; MANUFACTURER_PART_NUMBER: NANOSMDC020F-2; MOUSER_PART_NUMBER: 650-NANOSMDC020F-2; MOUSER_PRICE-STOCK: https://www.mouser.co.uk/ProductDetail/Littelfuse/NANOSMDC020F-2?qs=iK0evp%252BCRRU6agwMt7HYjg%3D%3D
FL1-FL3 = BLM18PG121SN1D:BLM18PG121SN1D: Ferrite bead SMD 0603 120R 2A Murata Ferrite Bead (Chip Ferrite Bead), 1.6 x 0.8 x 0.8mm (0603), 120 impedance at 100 MHz Source: Datasheet <https://www.murata.com/en-us/products/productdetail?partno=BLM18PG121SN1#>; ARROW_PART_NUMBER: BLM18PG121SN1D; ARROW_PRICE-STOCK: https://www.arrow.com/en/products/blm18pg121sn1d/murata-manufacturing?region=nac; DESCRIPTION: Ferrite bead SMD 0603 120R 2A Murata Ferrite Bead (Chip Ferrite Bead), 1.6 x 0.8 x 0.8mm (0603), 120 impedance at 100 MHz; HEIGHT: 0.95mm; MANUFACTURER_NAME: Murata Electronics; MANUFACTURER_PART_NUMBER: BLM18PG121SN1D; MOUSER_PART_NUMBER: 81-BLM18PG121SN1D; MOUSER_PRICE-STOCK: https://www.mouser.co.uk/ProductDetail/Murata-Electronics/BLM18PG121SN1D?qs=tY8e8KZalarVxhnmnUYZ1A%3D%3D
IC1-IC3 = AMS1117-3.3:AMS1117-3.3: 1A LOW DROPOUT VOLTAGE REGULATOR, SOT-223 Source: Datasheet <http://www.advanced-monolithic.com/pdf/ds1117.pdf>; ARROW_PART_NUMBER: AMS1117-3.3; DESCRIPTION: 1A LOW DROPOUT VOLTAGE REGULATOR, SOT-223; HEIGHT: 1.8mm; MANUFACTURER_NAME: Advanced Monolithic Systems; MANUFACTURER_PART_NUMBER: AMS1117-3.3
IC4 = CP2102N-A02-GQFN24R:CP2102N-A02-GQFN24R: USB Interface IC USB to UART bridge - QFN24 Source: Datasheet <https://www.silabs.com/documents/public/data-sheets/cp2102n-datasheet.pdf>; ARROW_PART_NUMBER: CP2102N-A02-GQFN24R; ARROW_PRICE-STOCK: https://www.arrow.com/en/products/cp2102n-a02-gqfn24r/silicon-labs; DESCRIPTION: USB Interface IC USB to UART bridge - QFN24; HEIGHT: 0.8mm; MANUFACTURER_NAME: Silicon Labs; MANUFACTURER_PART_NUMBER: CP2102N-A02-GQFN24R; MOUSER_PART_NUMBER: 634-CP2102NA02QFN24R; MOUSER_PRICE-STOCK: https://www.mouser.co.uk/ProductDetail/Silicon-Labs/CP2102N-A02-GQFN24R?qs=u16ybLDytRaIVBf0X4zL0g%3D%3D; SPICEPREFIX: X
IC5 = TB6612FNG_C_8_EL:TB6612FNG,C,8,EL: otor / Motion / Ignition Controllers & Drivers Brush Motor Driver IC Source: Datasheet <http://toshiba.semicon-storage.com/info/docget.jsp?did=10660&prodName=TB6612FNG>; ARROW_PART_NUMBER: TB6612FNG,C,8,EL; ARROW_PRICE-STOCK: https://www.arrow.com/en/products/tb6612fngc8el/toshiba?region=nac; DESCRIPTION: otor / Motion / Ignition Controllers & Drivers Brush Motor Driver IC; HEIGHT: 1.6mm; MANUFACTURER_NAME: Toshiba; MANUFACTURER_PART_NUMBER: TB6612FNG,C,8,EL; MOUSER_PART_NUMBER: 757-TB6612FNGC8EL; MOUSER_PRICE-STOCK: https://www.mouser.co.uk/ProductDetail/Toshiba/TB6612FNGC8EL?qs=rsevcuukUAy2UalRuv4E%2FQ%3D%3D
IC6 = MMDT3904-TP:MMDT3904-TP: Bipolar Transistors - BJT 200mA 40V Source: Datasheet <https://datasheet.datasheetarchive.com/originals/distributors/Datasheets_SAMA/783ffc00a4fcd19f10372299d3475a96.pdf>; ARROW_PART_NUMBER: MMDT3904-TP; ARROW_PRICE-STOCK: https://www.arrow.com/en/products/mmdt3904-tp/micro-commercial-components?region=nac; DESCRIPTION: Bipolar Transistors - BJT 200mA 40V; HEIGHT: 1.2mm; MANUFACTURER_NAME: Micro Commercial Components (MCC); MANUFACTURER_PART_NUMBER: MMDT3904-TP; MOUSER_PART_NUMBER: 833-MMDT3904-TP; MOUSER_PRICE-STOCK: https://www.mouser.co.uk/ProductDetail/Micro-Commercial-Components-MCC/MMDT3904-TP?qs=O2qRfqcg9D%252BXS9Ak8w1VHA%3D%3D
IC7 = W25Q128JVPIQ:W25Q128JVPIQ: IC FLASH 128M SPI 133MHZ 8WSON Source: Datasheet <https://www.arrow.com/en/products/w25q128jvpiq/winbond-electronics>; ARROW_PART_NUMBER: W25Q128JVPIQ; ARROW_PRICE-STOCK: https://www.arrow.com/en/products/w25q128jvpiq/winbond-electronics?region=nac; DESCRIPTION: IC FLASH 128M SPI 133MHZ 8WSON; HEIGHT: 0.8mm; MANUFACTURER_NAME: Winbond; MANUFACTURER_PART_NUMBER: W25Q128JVPIQ; MOUSER_PART_NUMBER: 454-W25Q128JVPIQ; MOUSER_PRICE-STOCK: https://www.mouser.co.uk/ProductDetail/Winbond/W25Q128JVPIQ?qs=qSfuJ%252Bfl%2Fd676hAD%252B1JSfw%3D%3D
IC8 = CD74HC4067SM96:CD74HC4067SM96: High Speed CMOS 16-Ch MUX/DEMUX 24P SOIC CD74HC4067SM96, Multiplexer/Demultiplexer Single 16:1, 3 V, 5 V, 24-Pin, SSOP, 1 Source: Datasheet <https://datasheet.datasheetarchive.com/originals/distributors/SFDatasheet-6/sf-000127204.pdf>; ARROW_PART_NUMBER: CD74HC4067SM96; ARROW_PRICE-STOCK: https://www.arrow.com/en/products/cd74hc4067sm96/texas-instruments?region=nac; DESCRIPTION: High Speed CMOS 16-Ch MUX/DEMUX 24P SOIC CD74HC4067SM96, Multiplexer/Demultiplexer Single 16:1, 3 V, 5 V, 24-Pin, SSOP, 1; HEIGHT: 2mm; MANUFACTURER_NAME: Texas Instruments; MANUFACTURER_PART_NUMBER: CD74HC4067SM96; MOUSER_PART_NUMBER: 595-CD74HC4067SM96; MOUSER_PRICE-STOCK: https://www.mouser.co.uk/ProductDetail/Texas-Instruments/CD74HC4067SM96?qs=JHHQeKcAU3DyfvAOSRLjhQ%3D%3D
IC9 = ESP32-D0WDQ6:ESP32-D0WDQ6: RF System on a Chip - SoC SMD IC ESP32-D0WDQ6, Dual Core MCU, WiFi & Bluetooth Combo, QFN48-pin, 6*6mm Source: Datasheet <https://www.espressif.com/sites/default/files/documentation/esp32_datasheet_en.pdf>; DESCRIPTION: RF System on a Chip - SoC SMD IC ESP32-D0WDQ6, Dual Core MCU, WiFi & Bluetooth Combo, QFN48-pin, 6*6mm; HEIGHT: 0.9mm; MANUFACTURER_NAME: Espressif Systems; MANUFACTURER_PART_NUMBER: ESP32-D0WDQ6; MOUSER_PART_NUMBER: 356-ESP32-D0WDQ6; MOUSER_PRICE-STOCK: https://www.mouser.co.uk/ProductDetail/Espressif-Systems/ESP32-D0WDQ6?qs=chTDxNqvsykWgzfXx0gR%252BQ%3D%3D
IC10 IC12 IC13 = 74HC595PW_118:74HC595PW,118: 74HC(T)595 - 8-bit serial-in, serial or parallel-out shift register with output latches; 3-state@en-us Source: Datasheet <https://assets.nexperia.com/documents/data-sheet/74HC_HCT595.pdf>; ARROW_PART_NUMBER: 74HC595PW,118; ARROW_PRICE-STOCK: https://www.arrow.com/en/products/74hc595pw118/nexperia?region=asia; DESCRIPTION: 74HC(T)595 - 8-bit serial-in, serial or parallel-out shift register with output latches; 3-state@en-us; HEIGHT: 1.1mm; MANUFACTURER_NAME: Nexperia; MANUFACTURER_PART_NUMBER: 74HC595PW,118; MOUSER_PART_NUMBER: 771-74HC595PW-T; MOUSER_PRICE-STOCK: https://www.mouser.co.uk/ProductDetail/Nexperia/74HC595PW118?qs=P62ublwmbi8GOYhe4PjE9Q%3D%3D
IC11 = MP1584EN-LF-Z:MP1584EN-LF-Z: Switching Voltage Regulators 3A 1.5MHz 28V Nonsync Buck Source: Datasheet <https://componentsearchengine.com/Datasheets/1/MP1584EN-LF-Z.pdf>; DESCRIPTION: Switching Voltage Regulators 3A 1.5MHz 28V Nonsync Buck; HEIGHT: 1.7mm; MANUFACTURER_NAME: Monolithic Power Systems (MPS); MANUFACTURER_PART_NUMBER: MP1584EN-LF-Z; MOUSER_PART_NUMBER: 946-MP1584ENLFZ; MOUSER_PRICE-STOCK: https://www.mouser.co.uk/ProductDetail/Monolithic-Power-Systems-MPS/MP1584EN-LF-Z?qs=rC7bBWoQAAktQUA%2FYI26vA%3D%3D
IC14 = MPU-6050:MPU-6050: Gyro & Accelerometer 6 Axis I2C,MEMs InvenSense MPU-6050 6-Axis Motion Sensor Module Source: Datasheet <http://store.invensense.com/datasheets/invensense/MPU-6050_DataSheet_V3 4.pdf>; ARROW_PART_NUMBER: MPU-6050; ARROW_PRICE-STOCK: https://www.arrow.com/en/products/mpu-6050/invensense; DESCRIPTION: Gyro & Accelerometer 6 Axis I2C,MEMs InvenSense MPU-6050 6-Axis Motion Sensor Module; HEIGHT: 0.95mm; MANUFACTURER_NAME: InvenSense Inc.; MANUFACTURER_PART_NUMBER: MPU-6050; MOUSER_PART_NUMBER: N/A; MOUSER_PRICE-STOCK: http://www.mouser.com/Search/ProductDetail.aspx?qs=u4fy%2fsgLU9O14B5JgyQFvg%3d%3d
J1 = 5-1814832-2:5-1814832-2: RF Connectors, SMA RF Interface, Jack, RF Connector Mated Outer Diameter (Approximate) .25 in [6.35 mm], 50 , Threaded, 3GHz Operating Frequency Source: Datasheet <https://www.te.com/commerce/DocumentDelivery/DDEController?Action=showdoc&DocId=Customer Drawing1814832CpdfEnglishENG_CD_1814832_C.pdf5-1814832-2>; ARROW_PART_NUMBER: 5-1814832-2; ARROW_PRICE-STOCK: https://www.arrow.com/en/products/5-1814832-2/te-connectivity?region=europe; DESCRIPTION: RF Connectors, SMA RF Interface, Jack, RF Connector Mated Outer Diameter (Approximate) .25 in [6.35 mm], 50 , Threaded, 3GHz Operating Frequency; HEIGHT: 9.5mm; MANUFACTURER_NAME: TE Connectivity; MANUFACTURER_PART_NUMBER: 5-1814832-2; MOUSER_PART_NUMBER: 571-5-1814832-2; MOUSER_PRICE-STOCK: https://www.mouser.co.uk/ProductDetail/TE-Connectivity/5-1814832-2?qs=Cb2nCFKsA8rPOrkEMAAQ4A%3D%3D
J2 = Eigene Library:XT_30
JP1 = pinhead2:PINHD-2X4: PIN HEADER
JP2 JP5 JP7 JP9 = pinhead2:PINHD-1X5: PIN HEADER
JP3 JP6 JP8 = pinhead2:PINHD-1X2: PIN HEADER
JP4 JP16 JP17 = pinhead:PINHD-2X3: PIN HEADER
JP10 JP13 = SparkFun-Jumpers:JUMPER-SMT_2_NO: Normally open jumper This jumper has two pads in close proximity to each other. Apply solder to close the connection. Round pads are easier to solder for beginners, but are a lot larger. SparkFun Product that uses the round pads: SparkFun EL Sequencer <https://www.sparkfun.com/products/12781>
JP11 JP12 JP14 JP15 = pinhead:PINHD-1X3: PIN HEADER
L1 = SMD-3225_4P16MHZ_20PF_10PPM_-4:SMD-3225_4P16MHZ_20PF_10PPM_-4: SMD-3225_4P16MHZ 20PF 10PPM -40~+85 Source: Datasheet <https://datasheet.lcsc.com/szlcsc/Zhejiang-Abel-Elec-SMD-3225-4P-16MHz-20pF-10ppm-40-85_C164049.pdf>; DESCRIPTION: SMD-3225_4P16MHZ 20PF 10PPM -40~+85; HEIGHT: 0.8mm; MANUFACTURER_NAME: TAE(Zhejiang Abel Elec); MANUFACTURER_PART_NUMBER: SMD-3225_4P16MHZ 20PF 10PPM -40~+85℃
L2 = LQH5BPB100MT0L:LQH5BPB100MT0L: LQH5BPB_T0 Series Inductor 10uH +/-20% 2020 (5050) Source: Datasheet <https://psearch.en.murata.com/inductor/product/LQH5BPB100MT0#.html>; DESCRIPTION: LQH5BPB_T0 Series Inductor 10uH +/-20% 2020 (5050); HEIGHT: 2.2mm; MANUFACTURER_NAME: Murata Electronics; MANUFACTURER_PART_NUMBER: LQH5BPB100MT0L; MOUSER_PART_NUMBER: 81-LQH5BPB100MT0L; MOUSER_PRICE-STOCK: https://www.mouser.co.uk/ProductDetail/Murata-Electronics/LQH5BPB100MT0L?qs=hNud%2FORuBR2eSUAobsF5Ww%3D%3D
Q1 Q2 = AO3407A:AO3407A: MOSFET P-CH 30V 4.3A SOT23 Source: Datasheet <http://www.aosmd.com/pdfs/datasheet/ao3407a.pdf>; ARROW_PART_NUMBER: AO3407A; ARROW_PRICE-STOCK: https://www.arrow.com/en/products/ao3407a/alpha-and-omega-semiconductor; DESCRIPTION: MOSFET P-CH 30V 4.3A SOT23; HEIGHT: 1.25mm; MANUFACTURER_NAME: Alpha & Omega Semiconductors; MANUFACTURER_PART_NUMBER: AO3407A
R1-R38 = rc-master-smd:R_: RESISTOR
RGB1 RGB2 = RGB LED:RGBLED
SW1 = Eigene Library:XKB7070-Z
TP1 TP3-TP13 = SparkFun-Connectors:TEST-POINT: SparkFun Test Points Bare copper test points for troubleshooting or In-Circuit-Testing. These are used by our Production team for verifying production board runs using pogo-pins on test beds. SparkFun Products: SparkFun LSM9DS1 Breakout <https://www.sparkfun.com/products/13284> SparkFun PSOC <https://www.sparkfun.com/products/13714> SparkFun Load Cell Amplifier <https://www.sparkfun.com/products/13879>
U1 = TYPE-C-31-M-12:TYPE-C-31-M-14; BUILT_BY: EMA_Cory; COPYRIGHT: Copyright (C) 2018 Accelerated Designs. All rights reserved; DATASHEET: https://datasheet.lcsc.com/szlcsc/1811101526_Korean-Hroparts-Elec-TYPE-C-31-M-14_C223907.pdf; MANUFACTURER_PART_NUMBER: TYPE-C-31-M-14; SOURCELIBRARY: HRO_Parts_Electronics_2020-03-18; VENDOR: HRO Electronics